# EAGLE design Wheel Speed Sensor rev 2 (EAGLE 9.5.2)
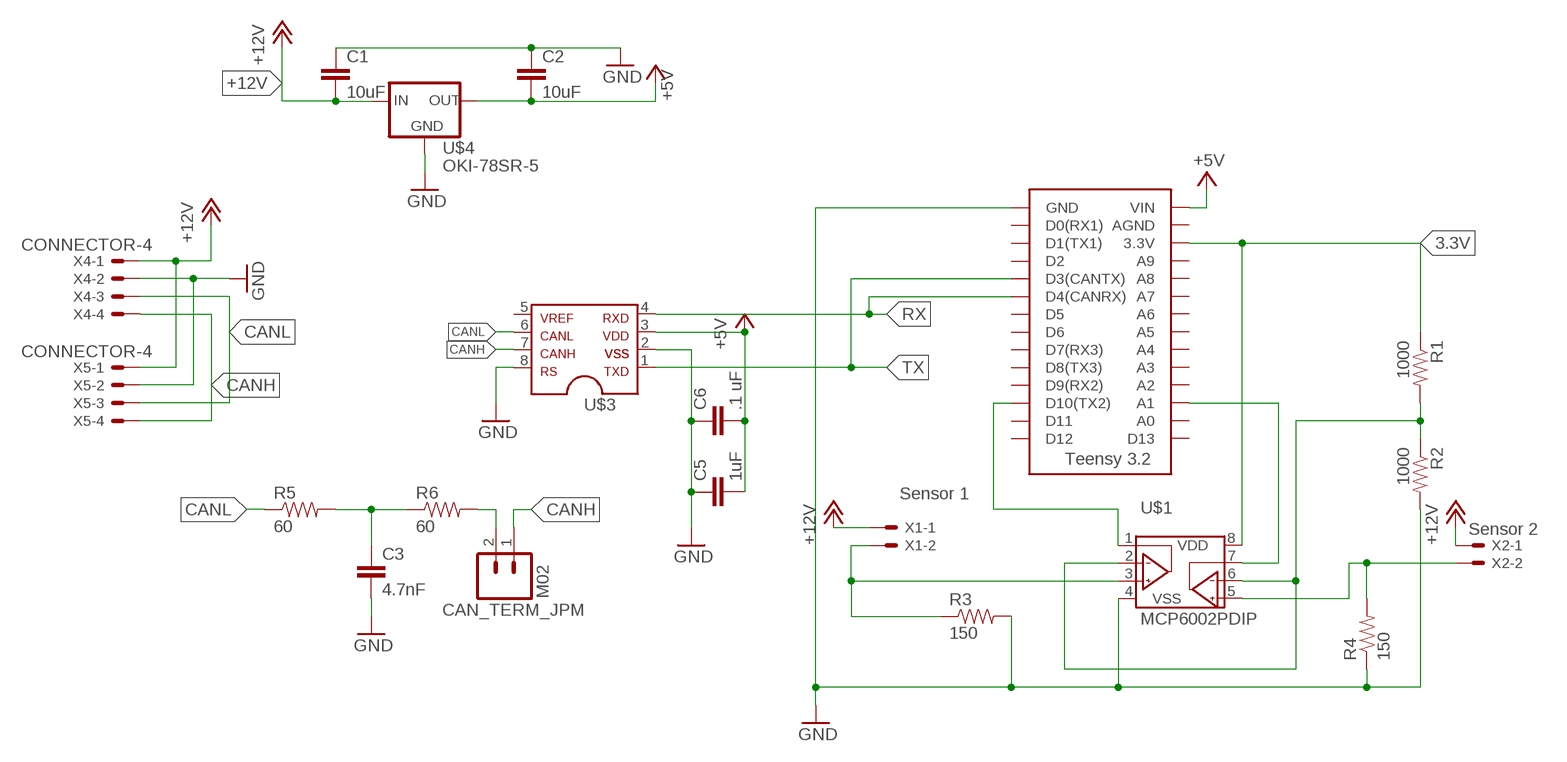
[diagram p0: schematic, sheet 1]

## Parts
C1  10uF  CAPPTH1  [CAP-PTH-5MM]
C2  10uF  CAPPTH1  [CAP-PTH-5MM]
C3  4.7nF  CAPPTH1  [CAP-PTH-5MM]
C5  1uF  CAPPTH1  [CAP-PTH-5MM]
C6  .1 uF  CAPPTH1  [CAP-PTH-5MM]
CAN_TERM_JPM  M02  [1X02]
R1  1000  RESISTORAXIAL-0.3  [AXIAL-0.3]
R2  1000  RESISTORAXIAL-0.3  [AXIAL-0.3]
R3  150  RESISTORAXIAL-0.3  [AXIAL-0.3]
R4  150  RESISTORAXIAL-0.3  [AXIAL-0.3]
R5  60  RESISTORAXIAL-0.3  [AXIAL-0.3]
R6  60  RESISTORAXIAL-0.3  [AXIAL-0.3]
U$1  MCP6002PDIP  [DIL08]
U$2  TEENSY_3.2_SIMPLE  [TEENSY_3.2_SIMPLE]
U$3  MCP2551  [SOIC-08]
U$4  OKI-78SR-5  [OKI-78SR]
X1  Sensor 1  CONNECTOR-2  [MINIFIT_5566-2]
X2  Sensor 2  CONNECTOR-2  [MINIFIT_5566-2]
X4  CONNECTOR-4  [MINIFIT_5566-4]
X5  CONNECTOR-4  [MINIFIT_5566-4]

## Nets
3.3V: R1.P$1 U$1.8(VDD) U$2.3.3V
+5V: C2.2 C5.2 C6.2 U$2.VIN U$3.3 U$4.3(OUT)
+12V: C1.2 U$4.1(IN) X1.1 X2.1 X4.1 X5.1
CANH: CAN_TERM_JPM.1 U$3.7 X4.4 X5.4
CANL: R5.P$1 U$3.6 X4.3 X5.3
GND: C1.1 C2.1 C3.2 C5.1 C6.1 R2.P$2 R3.P$2 R4.P$1 U$1.4(VSS) U$2.GND U$3.2 U$3.8 U$4.2(GND) X4.2 X5.2
N$2: R1.P$2 R2.P$1 U$1.2(VINA-) U$1.6(VINB-)
N$3: C3.1 R5.P$2 R6.P$1
N$4: R3.P$1 U$1.3(VINA+) X1.2
N$5: U$1.7(VOUTB) U$2.A1
N$6: U$1.1(VOUTA) U$2.D10(TX2)
N$8: R4.P$2 U$1.5(VINB+) X2.2
N$9: CAN_TERM_JPM.2 R6.P$2
RX: U$2.D4(CANRX) U$3.4
TX: U$2.D3(CANTX) U$3.1
Unconnected: U$2.A0 U$2.A2 U$2.A3 U$2.A4 U$2.A5 U$2.A6 U$2.A7 U$2.A8 U$2.A9 U$2.AGND U$2.D0(RX1) U$2.D1(TX1) U$2.D2 U$2.D5 U$2.D6 U$2.D7(RX3) U$2.D8(TX3) U$2.D9(RX2) U$2.D11 U$2.D12 U$2.D13 U$3.5

## Library data of the parts
C1-C3 C5 C6 = HyTechDevices:CAP: Capacitor Standard 0603 ceramic capacitor, and 0.1" leaded capacitor.
CAN_TERM_JPM = HyTechDevices:M02: Standard 2-pin 0.1" header. NOTES ON THE VARIANTS LOCK and LOCK_LONGPADS... This footprint was designed to help hold the alignment of a through-hole component (i.e. 6-pin header) while soldering it into place. You may notice that each hole has been shifted either up or down by 0.005 of an inch from it's more standard position (which is a perfectly straight line). This slight alteration caused the pins (the squares in the middle) to touch the edges of the holes. Because they are alternating, it causes a "brace" to hold the component in place. 0.005 has proven to be the perfect amount of "off-center" position when using our standard breakaway headers. Although looks a little odd when you look at the bare footprint, once you have a header in there, the alteration is very hard to notice. Also,if you push a header all the way into place, it is covered up entirely on the bottom side. This idea of altering the position of holes to aid alignment will be further integrated into the Sparkfun Library for other footprints. It can help hold any component with 3 or more connection pins. Note: The Sparkfun version includes many other packages including surface mount that may be of future interest. Source: Sparkfun <https://github.com/sparkfun/SparkFun-Eagle-Libraries>
R1-R6 = HyTechDevices:RESISTOR: Resistor Basic schematic elements and footprints for 0603, 1206, and PTH resistors.
U$1 = HyTechDevices:MCP6002: Microchip MCP6002 Dual Channel Op Amp
U$2 = HyTechDevices:TEENSY_3.2_SIMPLE: Simple version of the Teensy 3.2 board that only uses the 2 main rows of pins, not the inner pins or the pins opposite the usb port.
U$3 = HyTechDevices:MCP2551: MCP2551 High-Speed CAN Transceiver Product Webpage <https://www.microchip.com/wwwproducts/en/MCP2551> Datasheet <http://ww1.microchip.com/downloads/en/DeviceDoc/21667f.pdf> This device is outdated It is replaced by MCP2561. Comparison Page <https://www.microchip.com/wwwproducts/ProductCompare/MCP2551/MCP2561> Product Webpage <https://www.microchip.com/wwwproducts/en/MCP2561> Datasheet <http://ww1.microchip.com/downloads/en/DeviceDoc/20005167C.pdf>
U$4 = HyTechDevices:OKI-78SR-5: Murata OKI-78SR 5V 1.5A Non-Isolated Switching Regulator DC/DC - Datasheet <https://power.murata.com/data/power/oki-78sr.pdf>
X1 X2 = HyTechDevices:CONNECTOR-2: Mini-Fit Junior connector 2 pole Source: http://www.molex.com; OC_FARNELL: 1822072; OC_NEWARK: unknown
X4 X5 = HyTechDevices:CONNECTOR-4: Mini-Fit Junior connector 4 pole Source: http://www.molex.com; OC_FARNELL: unknown; OC_NEWARK: unknown

## Board
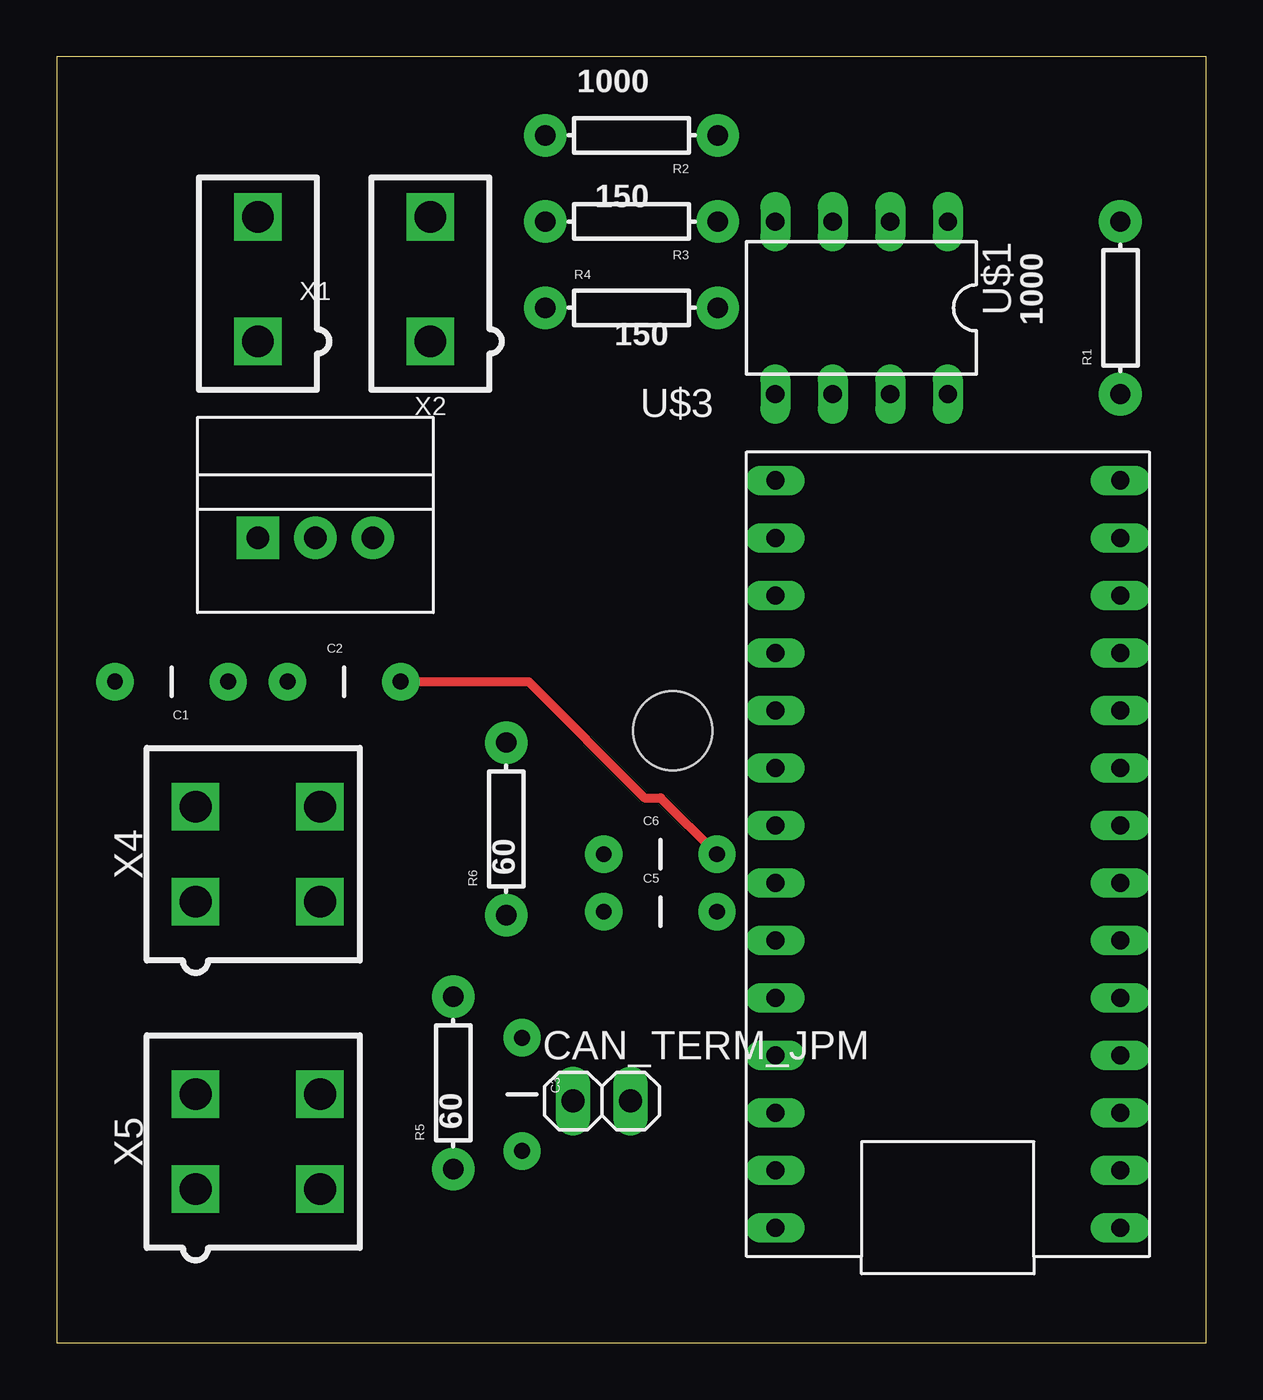
[diagram p1: board, top side]
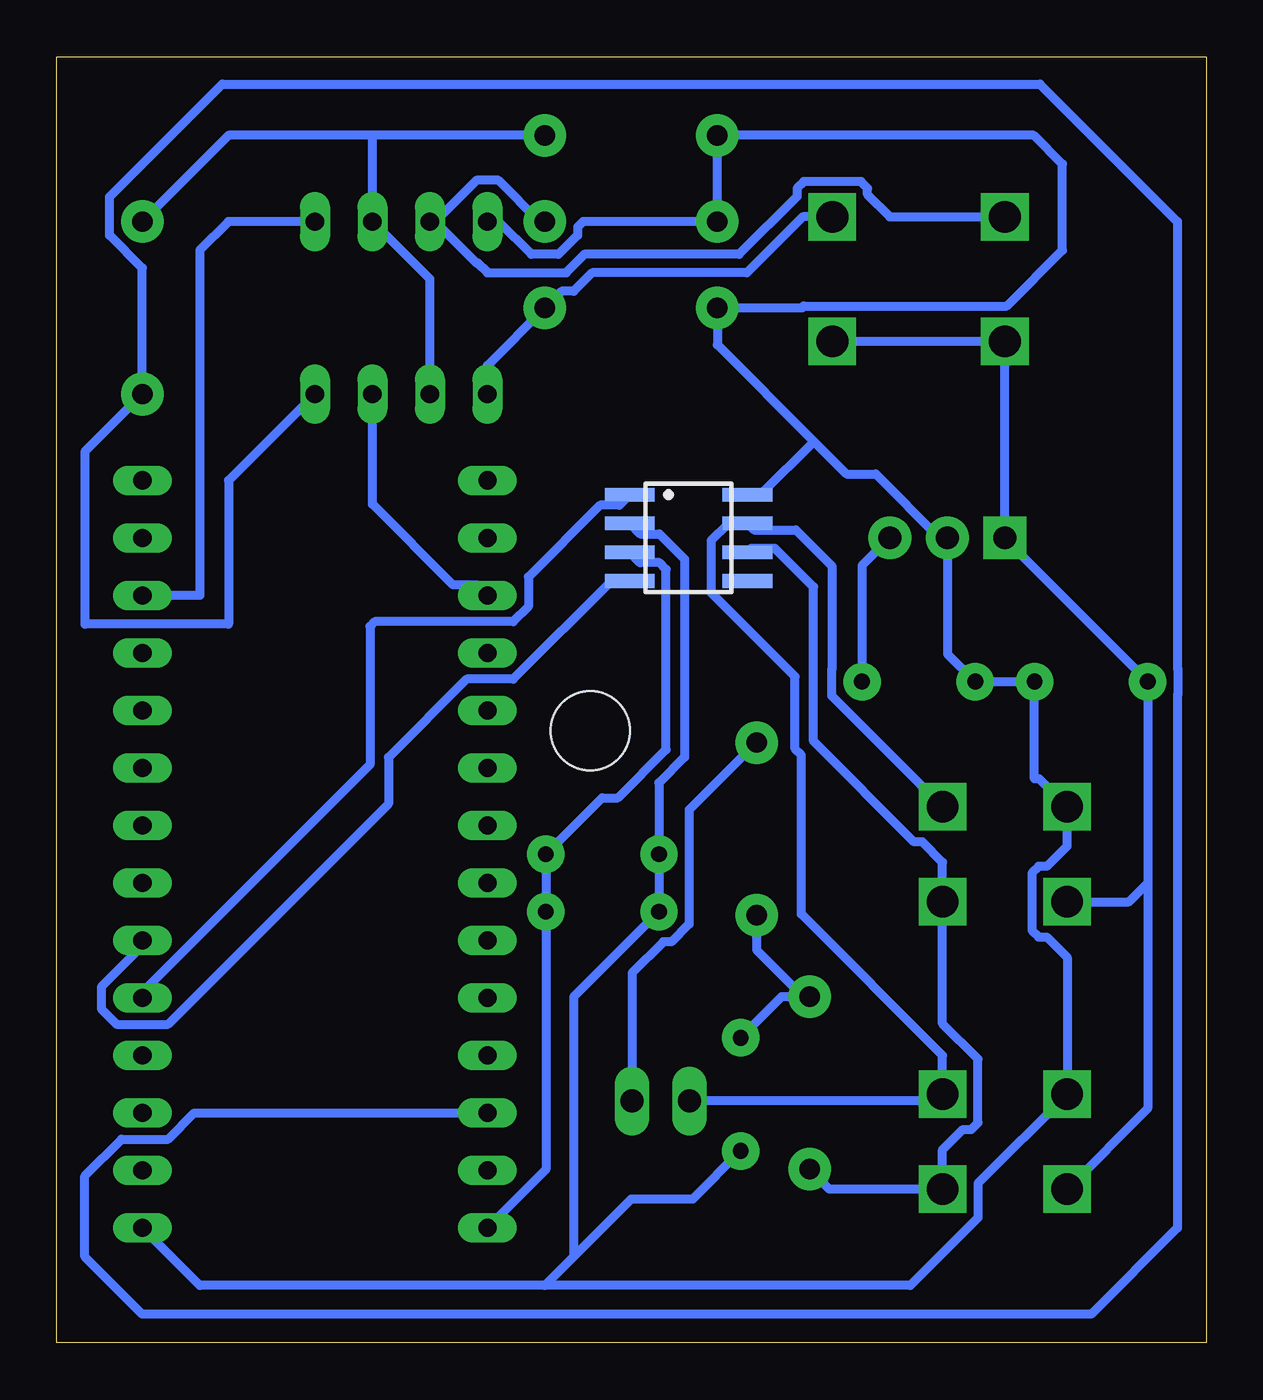
[diagram p2: board, bottom side, seen from below]

Size 50.78 x 56.82 mm. Coordinates in mm from the lower left corner, seen from the top.
Outline: 0,0 50.78,0 50.78,56.82 0,56.82 0,0
Copper layers (1*16): Top 0.035mm / dielectric 1.5mm / Bottom 0.035mm
Design rules "DRC Electronics Lab": minimum track width 16mil, minimum drill 19mil, track to track 16mil, track to pad 12mil, pad to pad 16mil, via to via 16mil, smd to smd 10mil, copper to edge 40mil, drill to drill 10mil, minimum pad ring 10mil, minimum via ring 8mil, stop-mask expansion 4mil, vias tented up to drill 0mil, thermal gap 10mil
Holes 3.5 mm at 27.21,27.05

### Footprints (pad centres in the part's own frame; a part is rotated, then mirrored left to right if it is on the bottom)
CAP-PTH-5MM = drill 0.7 pad 1.651: 1 -2.5,0; 2 2.5,0
1X02 = drill 1.016 long: 1 -1.27,0; 2 1.27,0
AXIAL-0.3 = drill 0.9 pad 1.88: P$1 -3.81,0; P$2 3.81,0
DIL08 = drill 0.813 long: 1 -3.81,-3.81; 2 -1.27,-3.81; 3 1.27,-3.81; 4 3.81,-3.81; 5 3.81,3.81; 6 1.27,3.81; 7 -1.27,3.81; 8 -3.81,3.81
TEENSY_3.2_SIMPLE = drill 0.8 long: 3.3V 16.51,29.21; A0 16.51,3.81; A1 16.51,6.35; A2 16.51,8.89; A3 16.51,11.43; A4 16.51,13.97; A5 16.51,16.51; A6 16.51,19.05; A7 16.51,21.59; A8 16.51,24.13; A9 16.51,26.67; AGND 16.51,31.75; D0(RX1) 1.27,31.75; D1(TX1) 1.27,29.21; D2 1.27,26.67; D3(CANTX) 1.27,24.13; D4(CANRX) 1.27,21.59; D5 1.27,19.05; D6 1.27,16.51; D7(RX3) 1.27,13.97; D8(TX3) 1.27,11.43; D9(RX2) 1.27,8.89; D10(TX2) 1.27,6.35; D11 1.27,3.81; D12 1.27,1.27; D13 16.51,1.27; GND 1.27,34.29; VIN 16.51,34.29
SOIC-08 = smd 0.6 x 2.2: 1 -1.905,-2.6; 2 -0.635,-2.6; 3 0.635,-2.6; 4 1.905,-2.6; 5 1.905,2.6; 6 0.635,2.6; 7 -0.635,2.6; 8 -1.905,2.6
OKI-78SR = drill 1 pad 1.88 square: 1 -2.54,0 | drill 1 pad 1.88: 2 0,0; 3 2.54,0
MINIFIT_5566-2 = drill 1.4 square: 1 0,-2.75; 2 0,2.75
MINIFIT_5566-4 = drill 1.4 square: 1 2.1,-2.75; 2 -2.1,-2.75; 3 2.1,2.75; 4 -2.1,2.75

### Placement (x,y rotation side)
C1  5.08,29.21 180 top
C2  12.7,29.21 0 top
C3  20.56,10.98 270 top
C5  26.67,19.05 0 top
C6  26.67,21.59 0 top
CAN_TERM_JPM  24.09,10.69 0 top
R1  46.99,45.72 90 top
R2  25.4,53.34 180 top
R3  25.4,49.53 180 top
R4  25.4,45.72 0 top
R5  17.52,11.48 90 top
R6  19.86,22.71 90 top
U$1  35.56,45.72 180 top
U$2  48.26,39.37 180 top
U$3  22.86,35.56 270 bottom
U$4  11.43,35.56 0 top
X1  8.89,46.99 0 top
X2  16.51,46.99 0 top
X4  8.89,21.59 270 top
X5  8.89,8.89 270 top

### Tracks (layer width: path | path; a pad name or v marks a point on that pad's centre or on a via)
3.3V
  Bottom 0.406: U$1.8 43.18,38.1 43.18,31.75 49.53,31.75 49.53,39.37 R1.P$1 46.99,47.48 48.44,48.93 48.44,50.62 43.46,55.6 7.34,55.6 1.27,49.53 1.27,29.79 1.25,29.76 1.25,28.66 1.27,28.63 1.27,5.08 5.08,1.27 46.99,1.27 49.53,3.81 49.53,7.38 47.91,9 45.86,9 44.69,10.16 U$2.3.3V
+5V
  Top 0.406: C6.2 26.68,24.08 25.98,24.08 20.85,29.21 C2.2
  Bottom 0.406: U$4.3 15.2,34.33 C2.2 | U$2.VIN 29.17,7.66 C5.2 C6.2 26.68,24.08 25.98,24.08 23.85,26.21 23.85,34.16 24.15,34.46 25,34.46 U$3.3
+12V
  Bottom 0.406: 2.58,20.32 C1.2 8.89,35.52 U$4.1 X1.1 X2.1 | 2.58,20.32 2.58,10.35 X5.1 | X4.1 3.41,19.49 2.58,20.32
CANH
  Bottom 0.406: CAN_TERM_JPM.1 11.94,10.69 X5.4 11.64,12.7 17.89,18.95 17.89,25.97 18.16,26.24 18.16,29.44 21.87,33.15 21.87,35.44 21.11,36.2 U$3.7 19.97,35.91 18.13,35.91 16.51,34.29 16.51,29.79 16.53,29.76 16.53,28.58 X4.4
CANL
  Bottom 0.406: R5.P$1 16.64,6.79 X5.3 11.64,8.53 10.74,9.43 10.38,9.43 10.08,9.73 10.08,12.54 11.64,14.1 X4.3 11.64,21.23 12.54,22.13 12.9,22.13 17.35,26.58 17.35,33.39 19.05,35.09 20.09,35.09 U$3.6
GND
  Bottom 0.406: U$2.GND 44.45,2.54 29.21,2.54 | 17.33,39.82 21.59,44.09 R4.P$1 17.85,45.72 17.77,45.8 8.81,45.8 6.35,48.26 6.35,52.07 7.62,53.34 R2.P$2 R3.P$2 27.52,49.53 27.76,49.29 27.76,48.93 28.61,48.08 29.81,48.08 31.26,49.53 U$1.4 | 17.33,39.82 15.88,38.38 14.6,38.38 11.78,35.56 U$4.2 11.43,30.44 C2.1 C1.1 7.58,24.92 7.37,24.92 X4.2 6.14,21.95 7.04,21.05 7.4,21.05 7.7,20.75 7.7,18.23 7.4,17.93 7.04,17.93 6.14,17.03 X5.2 10.08,7.05 10.08,5.53 13.07,2.54 29.21,2.54 | 27.94,3.81 25.4,6.35 22.69,6.35 C3.2 | 27.94,3.81 29.21,2.54 | 27.94,3.81 27.94,15.28 C5.1 C6.1 24.17,24.74 23.04,25.87 23.04,34.62 24.15,35.73 25,35.73 U$3.2 | U$3.8 19.69,37.47 17.33,39.82
N$2
  Bottom 0.406: R2.P$1 36.83,53.34 | 36.83,53.34 43.18,53.34 R1.P$2 | 36.83,53.34 U$1.2 34.29,46.99 U$1.6
N$3
  Bottom 0.406: 17.78,15.29 18.75,15.29 C3.1 | R6.P$1 19.86,17.37 17.78,15.29 | R5.P$2 17.78,15.29
N$4
  Bottom 0.406: X1.2 13.97,49.74 14.95,50.72 14.95,51 15.25,51.3 17.77,51.3 18.07,51 18.07,50.64 20.63,48.08 27.46,48.08 28.27,47.27 31.75,47.27 32.18,47.7 32.23,47.7 34.06,49.53 | R3.P$1 29.44,49.53 31.27,51.36 32.23,51.36 34.06,49.53 | 34.06,49.53 U$1.3
N$5
  Bottom 0.406: U$2.A1 32.21,33.48 33.26,33.48 36.83,37.05 U$1.7
N$6
  Bottom 0.406: U$1.1 43.18,49.53 44.45,48.26 44.45,33.02 U$2.D10(TX2)
N$8
  Bottom 0.406: U$1.5 31.75,43.18 R4.P$2 28.47,46.46 27.94,46.46 27.12,47.27 20.29,47.27 17.82,49.74 X2.2
N$9
  Bottom 0.406: CAN_TERM_JPM.2 25.36,16.33 23.98,17.72 23.62,17.72 22.84,18.5 22.84,23.54 R6.P$2
RX
  Bottom 0.406: U$3.4 26.28,33.66 30.62,29.32 32.67,29.32 36.12,25.87 36.12,23.81 45.86,14.08 48.12,14.08 48.81,14.76 48.81,15.72 46.99,17.54 U$2.D4(CANRX)
TX
  Bottom 0.406: U$3.1 25.92,37 26.77,37 29.93,33.84 29.93,32.54 30.62,31.86 36.72,31.86 36.93,31.65 36.93,25.54 46.99,15.48 U$2.D3(CANTX)